# EAGLE design Daysuntil (EAGLE 6.3)
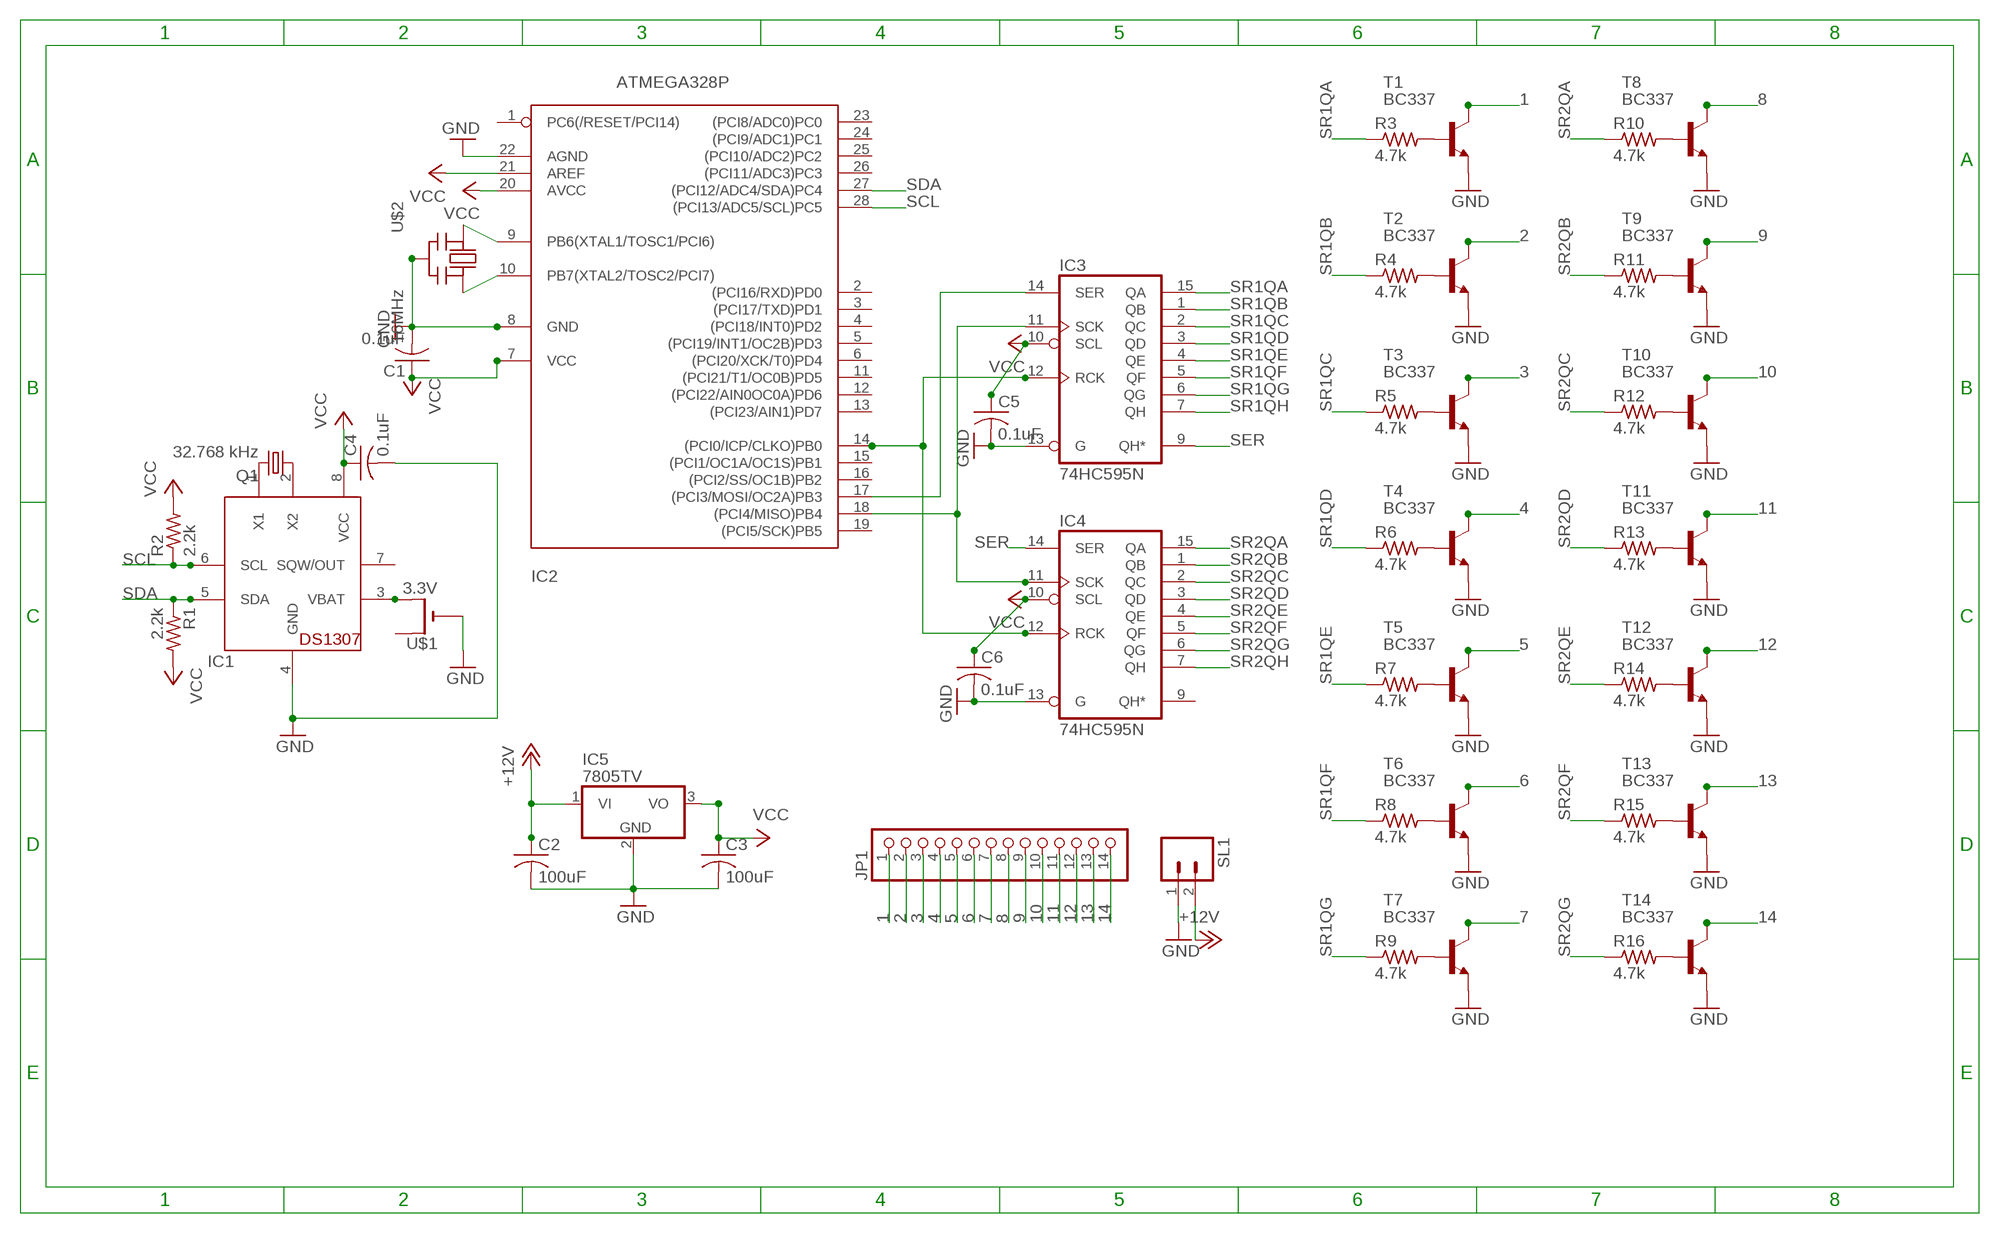
[diagram p0: schematic, sheet 1]

## Parts
C1  0.1uF  C-US025-030X050  [C025-030X050]
C2  100uF  C-US050-050X075  [C050-050X075]
C3  100uF  C-US050-050X075  [C050-050X075]
C4  0.1uF  C-US025-030X050  [C025-030X050]
C5  0.1uF  C-US025-030X050  [C025-030X050]
C6  0.1uF  C-US025-030X050  [C025-030X050]
IC1  DS1307  [DIL08]
IC2  ATMEGA328P  ATMEGA168-20P  [DIL28-3]
IC3  74HC595N  [DIL16]
IC4  74HC595N  [DIL16]
IC5  7805TV  [TO220V]
JP1  PINHD-1X14  [1X14]
Q1  32.768 kHz  CRYSTALTC38H  [TC38H]
R1  2.2k  R-US_0309/V  [0309V]
R2  2.2k  R-US_0309/V  [0309V]
R3  4.7k  R-US_0309/V  [0309V]
R4  4.7k  R-US_0309/V  [0309V]
R5  4.7k  R-US_0309/V  [0309V]
R6  4.7k  R-US_0309/V  [0309V]
R7  4.7k  R-US_0309/V  [0309V]
R8  4.7k  R-US_0309/V  [0309V]
R9  4.7k  R-US_0309/V  [0309V]
R10  4.7k  R-US_0309/V  [0309V]
R11  4.7k  R-US_0309/V  [0309V]
R12  4.7k  R-US_0309/V  [0309V]
R13  4.7k  R-US_0309/V  [0309V]
R14  4.7k  R-US_0309/V  [0309V]
R15  4.7k  R-US_0309/V  [0309V]
R16  4.7k  R-US_0309/V  [0309V]
SL1  M02  [02P]
T1  BC337  [TO92]
T2  BC337  [TO92]
T3  BC337  [TO92]
T4  BC337  [TO92]
T5  BC337  [TO92]
T6  BC337  [TO92]
T7  BC337  [TO92]
T8  BC337  [TO92]
T9  BC337  [TO92]
T10  BC337  [TO92]
T11  BC337  [TO92]
T12  BC337  [TO92]
T13  BC337  [TO92]
T14  BC337  [TO92]
U$1  3.3V  CR1220THM  [CR1220-THM]
U$2  16MHz  CERMOSCILL-THM  [CERM_OSC]

## Nets
1: JP1.1 T1.3(C)
2: JP1.2 T2.3(C)
3: JP1.3 T3.3(C)
4: JP1.4 T4.3(C)
5: JP1.5 T5.3(C)
6: JP1.6 T6.3(C)
7: JP1.7 T7.3(C)
8: JP1.8 T8.3(C)
9: JP1.9 T9.3(C)
10: JP1.10 T10.3(C)
11: JP1.11 T11.3(C)
12: JP1.12 T12.3(C)
13: JP1.13 T13.3(C)
14: JP1.14 T14.3(C)
+12V: C2.1 IC5.1(VI) SL1.2
GND: C1.2 C2.2 C3.2 C4.2 C5.2 C6.2 IC1.4(GND) IC2.8(GND) IC2.22(AGND) IC3.13(G) IC4.13(G) IC5.2(GND) SL1.1 T1.1(E) T2.1(E) T3.1(E) T4.1(E) T5.1(E) T6.1(E) T7.1(E) T8.1(E) T9.1(E) T10.1(E) T11.1(E) T12.1(E) T13.1(E) T14.1(E) U$1.- U$2.P$2(GND)
N$1: R3.2 T1.2(B)
N$2: IC2.17((PCI3/MOSI/OC2A)PB3) IC3.14(SER)
N$3: IC1.3(VBAT) U$1.+2(+1)
N$4: IC1.1(X1) Q1.2
N$5: IC1.2(X2) Q1.1
N$6: IC2.18((PCI4/MISO)PB4) IC3.11(SCK) IC4.11(SCK)
N$7: IC2.14((PCI0/ICP/CLKO)PB0) IC3.12(RCK) IC4.12(RCK)
N$8: IC2.9(PB6(XTAL1/TOSC1/PCI6)) U$2.P$1(IN)
N$9: IC2.10(PB7(XTAL2/TOSC2/PCI7)) U$2.P$3(OUT)
N$10: R4.2 T2.2(B)
N$11: R5.2 T3.2(B)
N$12: R6.2 T4.2(B)
N$13: R7.2 T5.2(B)
N$14: R8.2 T6.2(B)
N$15: R9.2 T7.2(B)
N$16: R10.2 T8.2(B)
N$17: R11.2 T9.2(B)
N$18: R12.2 T10.2(B)
N$19: R13.2 T11.2(B)
N$20: R14.2 T12.2(B)
N$21: R15.2 T13.2(B)
N$22: R16.2 T14.2(B)
SCL: IC1.6(SCL) IC2.28((PCI13/ADC5/SCL)PC5) R2.1
SDA: IC1.5(SDA) IC2.27((PCI12/ADC4/SDA)PC4) R1.1
SER: IC3.9(QH*) IC4.14(SER)
SR1QA: IC3.15(QA) R3.1
SR1QB: IC3.1(QB) R4.1
SR1QC: IC3.2(QC) R5.1
SR1QD: IC3.3(QD) R6.1
SR1QE: IC3.4(QE) R7.1
SR1QF: IC3.5(QF) R8.1
SR1QG: IC3.6(QG) R9.1
SR1QH: IC3.7(QH)
SR2QA: IC4.15(QA) R10.1
SR2QB: IC4.1(QB) R11.1
SR2QC: IC4.2(QC) R12.1
SR2QD: IC4.3(QD) R13.1
SR2QE: IC4.4(QE) R14.1
SR2QF: IC4.5(QF) R15.1
SR2QG: IC4.6(QG) R16.1
SR2QH: IC4.7(QH)
VCC: C1.1 C3.1 C4.1 C5.1 C6.1 IC1.8(VCC) IC2.7(VCC) IC2.20(AVCC) IC2.21(AREF) IC3.10(SCL) IC4.10(SCL) IC5.3(VO) R1.2 R2.2
Unconnected: IC1.7(SQW/OUT) IC2.1(PC6(/RESET/PCI14)) IC2.2((PCI16/RXD)PD0) IC2.3((PCI17/TXD)PD1) IC2.4((PCI18/INT0)PD2) IC2.5((PCI19/INT1/OC2B)PD3) IC2.6((PCI20/XCK/T0)PD4) IC2.11((PCI21/T1/OC0B)PD5) IC2.12((PCI22/AIN0OC0A)PD6) IC2.13((PCI23/AIN1)PD7) IC2.15((PCI1/OC1A/OC1S)PB1) IC2.16((PCI2/SS/OC1B)PB2) IC2.19((PCI5/SCK)PB5) IC2.23((PCI8/ADC0)PC0) IC2.24((PCI9/ADC1)PC1) IC2.25((PCI10/ADC2)PC2) IC2.26((PCI11/ADC3)PC3) IC4.9(QH*) U$1.+1(+)

## Power pins joined to a net without a drawn wire
GND: IC3.8(GND) IC4.8(GND)
VCC: IC3.16(VCC) IC4.16(VCC)

## Library data of the parts
C1-C6 = adafruit:C-US: CAPACITOR, American symbol
IC1 = adafruit:DS1307: DS1307 Real time clock (RTC) with battery backup ability. Talk to it via i2c
IC2 = adafruit:ATMEGA168*P: MICROCONTROLLER 16 kBytes FLASH 1 kBytes SRAM 512 Bytes EEPROM USART 8-channel 10 bit ADC
IC3 IC4 = 74xx-eu:74*595: 8-bit SHIFT REGISTER, output latch
IC5 = linear:78*: Positive VOLTAGE REGULATOR Source: http://cache.national.com/ds/LM/LM78L05.pdf http://www.fairchildsemi.com/ds/LM/LM7805.pdf
JP1 = pinhead:PINHD-1X14: PIN HEADER
Q1 = crystal:CRYSTAL: CRYSTAL; OC_FARNELL: unknown; OC_NEWARK: unknown
R1-R16 = adafruit:R-US_: RESISTOR, American symbol
SL1 = con-amp-quick:M02: AMP QUICK CONNECTOR; OC_FARNELL: unknown; OC_NEWARK: unknown
T1-T14 = transistor-neu-to92:BC337: NPN TRANSISTOR
U$1 = adafruit:CR1220: CR1216/CR1220/CR1225 12mm 3V lithium coin cell Great for battery packup. Both SMT and THM holders. Note the THM package has the ground pads on both sides of the PCB so that the masks are the same - this reduces the cost
U$2 = adafruit:CERMOSCILL: Ceramic oscillator with built in capacitors such as ZTT-12MHz http://www.ladyada.net/library/eagle

## Board
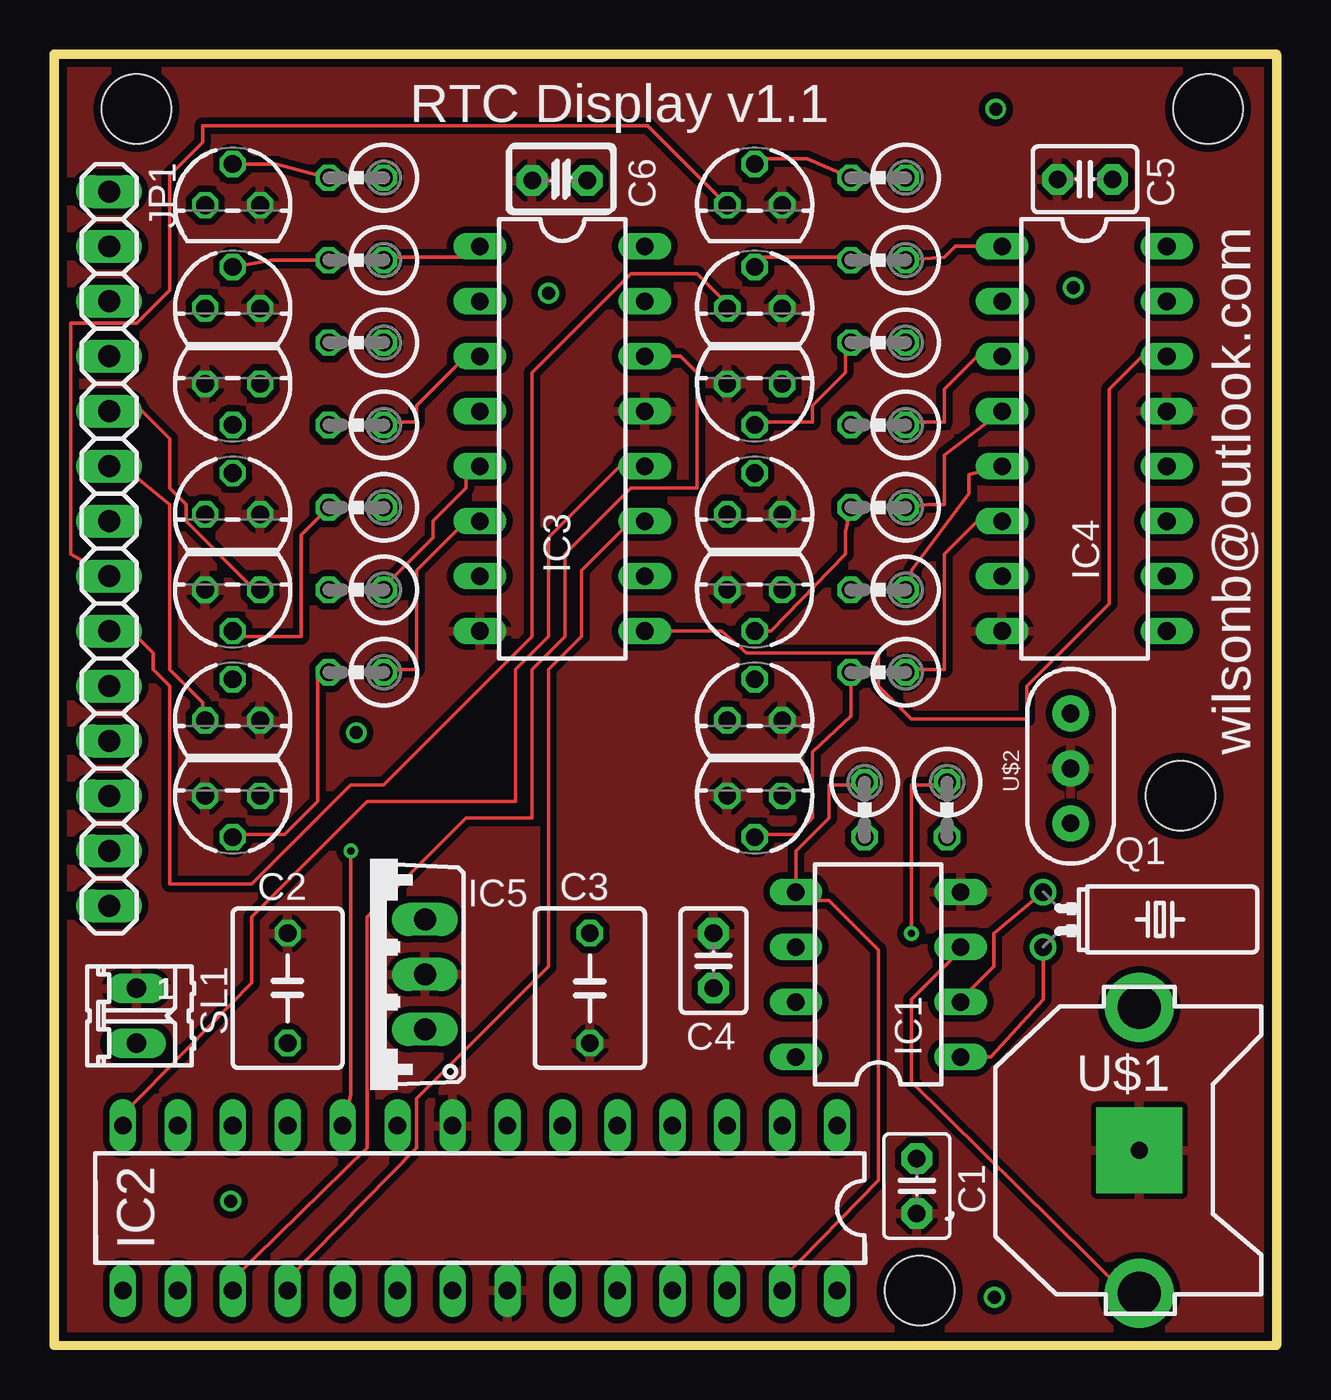
[diagram p1: board, top side]
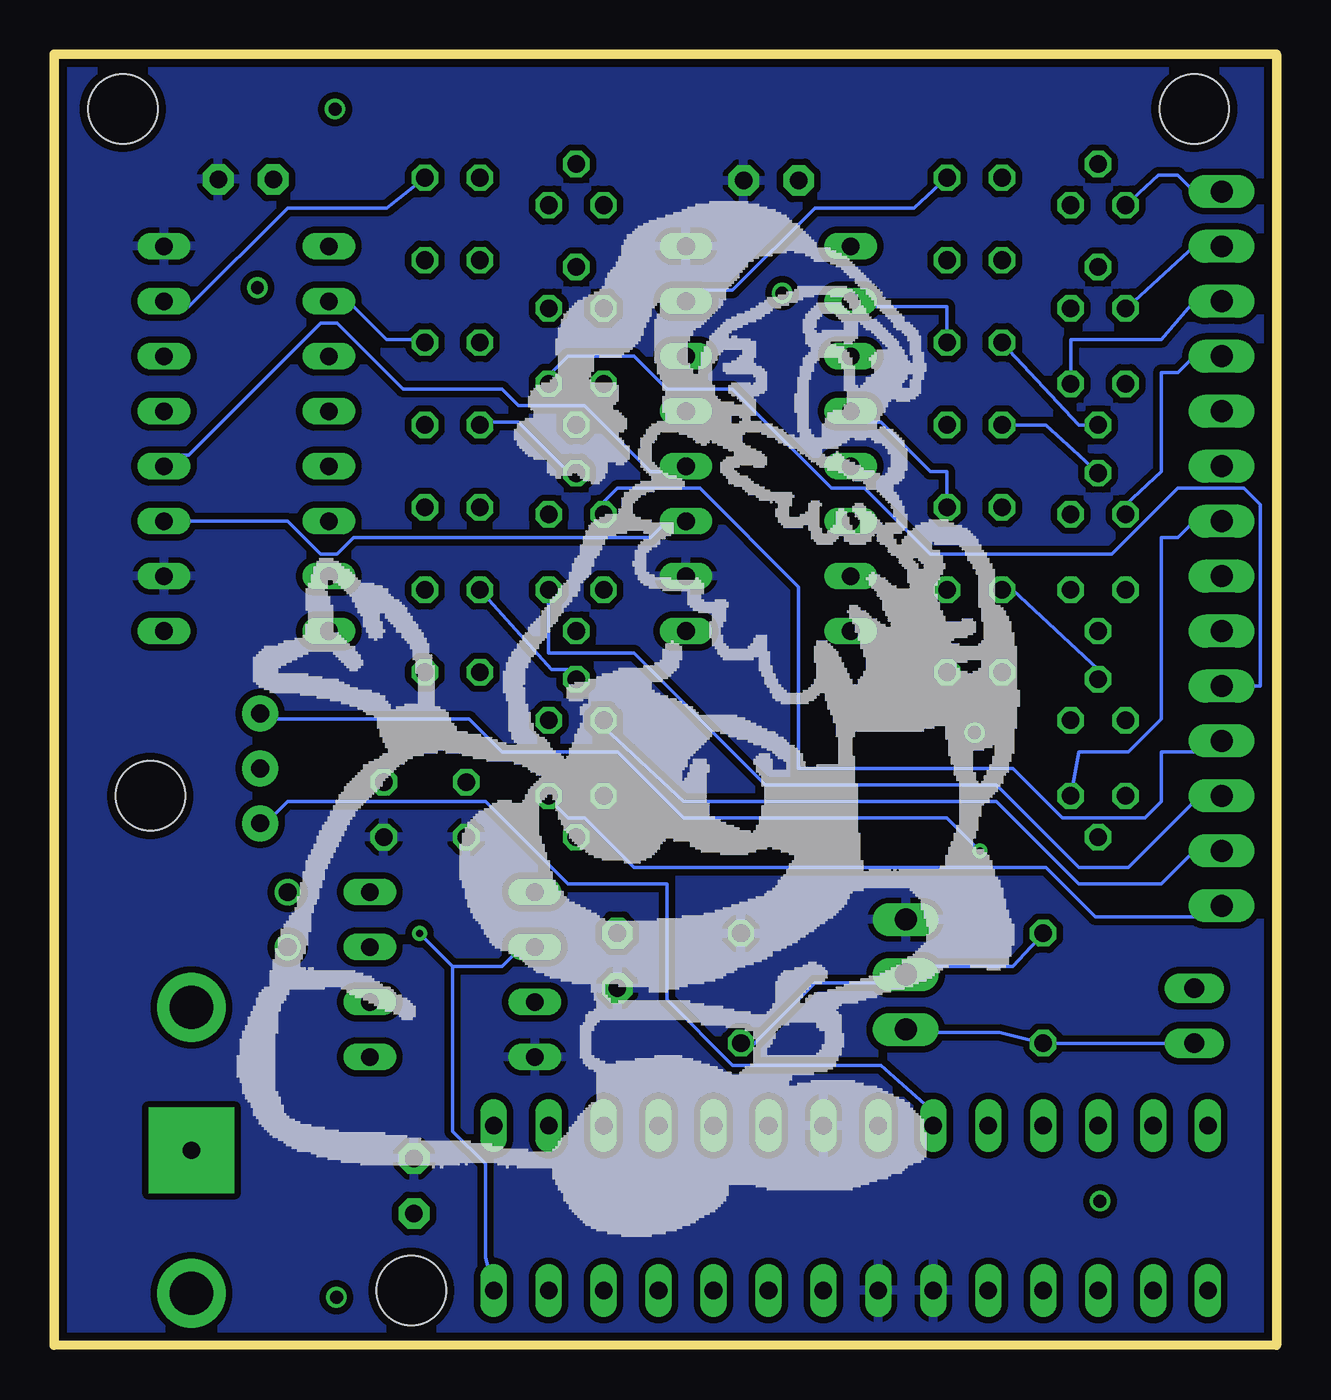
[diagram p2: board, bottom side, seen from below]

Size 56.52 x 59.69 mm. Coordinates in mm from the lower left corner, seen from the top.
Outline: 0,59.69 56.52,59.69 56.52,0 0,0 0,59.69
Copper layers (1*16): Top 0.0356mm / dielectric 1.5011mm / Bottom 0.0356mm
Design rules "LaenPCBOrder": minimum track width 6mil, minimum drill 13mil, track to track 6mil, track to pad 6mil, pad to pad 6mil, via to via 6mil, smd to smd 6mil, copper to edge 15mil, drill to drill 6mil, minimum pad ring 7mil, minimum via ring 7mil, stop-mask expansion 4mil, vias tented up to drill 0mil, thermal gap 10mil
Holes 3.2 mm at 40.01,2.54 53.34,57.15 52.07,25.4 3.81,57.15
Milling: 4 lines

### Footprints (pad centres in the part's own frame; a part is rotated, then mirrored left to right if it is on the bottom)
C025-030X050 = drill 0.813 pad 1.422 octagon: 1 -1.27,0; 2 1.27,0
C050-050X075 = drill 0.813 octagon: 1 -2.54,0; 2 2.54,0
DIL08 = drill 0.813 long: 1 -3.81,-3.81; 2 -1.27,-3.81; 3 1.27,-3.81; 4 3.81,-3.81; 5 3.81,3.81; 6 1.27,3.81; 7 -1.27,3.81; 8 -3.81,3.81
DIL28-3 = drill 0.813 long: 1 -16.51,-3.81; 2 -13.97,-3.81; 3 -11.43,-3.81; 4 -8.89,-3.81; 5 -6.35,-3.81; 6 -3.81,-3.81; 7 -1.27,-3.81; 8 1.27,-3.81; 9 3.81,-3.81; 10 6.35,-3.81; 11 8.89,-3.81; 12 11.43,-3.81; 13 13.97,-3.81; 14 16.51,-3.81; 15 16.51,3.81; 16 13.97,3.81; 17 11.43,3.81; 18 8.89,3.81; 19 6.35,3.81; 20 3.81,3.81; 21 1.27,3.81; 22 -1.27,3.81; 23 -3.81,3.81; 24 -6.35,3.81; 25 -8.89,3.81; 26 -11.43,3.81; 27 -13.97,3.81; 28 -16.51,3.81
DIL16 = drill 0.813 long: 1 -8.89,-3.81; 2 -6.35,-3.81; 3 -3.81,-3.81; 4 -1.27,-3.81; 5 1.27,-3.81; 6 3.81,-3.81; 7 6.35,-3.81; 8 8.89,-3.81; 9 8.89,3.81; 10 6.35,3.81; 11 3.81,3.81; 12 1.27,3.81; 13 -1.27,3.81; 14 -3.81,3.81; 15 -6.35,3.81; 16 -8.89,3.81
TO220V = drill 1.016 long: 1 -2.54,-2.54; 2 0,-2.54; 3 2.54,-2.54
1X14 = drill 1.016 long: 1 -16.51,0; 2 -13.97,0; 3 -11.43,0; 4 -8.89,0; 5 -6.35,0; 6 -3.81,0; 7 -1.27,0; 8 1.27,0; 9 3.81,0; 10 6.35,0; 11 8.89,0; 12 11.43,0; 13 13.97,0; 14 16.51,0
TC38H = drill 0.813: 1 -1.27,0; 2 1.27,0
0309V = drill 0.813 octagon: 1 -1.27,0; 2 1.27,0
02P = drill 0.914 long: 1 -1.27,0; 2 1.27,0
TO92 = drill 0.813 octagon: 1 1.27,0; 2 0,1.905; 3 -1.27,0
CR1220-THM = drill 2 pad 3.175: +1 -6.604,0; +2 6.604,0 | drill 0.8 pad 3.962 square: - 0,0
CERM_OSC = drill 0.813 pad 1.676: P$1 -2.54,0; P$2 0,0; P$3 2.54,0

### Placement (x,y rotation side)
C1  39.88,7.37 270 top
C2  10.79,16.51 90 top
C3  24.77,16.51 270 top
C4  30.48,17.78 90 top
C5  47.66,53.9 180 top
C6  23.37,53.85 180 top
IC1  38.1,17.14 90 top
IC2  19.68,6.35 180 top
IC3  23.5,41.91 270 top
IC4  47.62,41.91 270 top
IC5  14.61,17.14 90 top
JP1  2.54,36.83 270 top
Q1  45.72,19.68 270 top
R1  37.47,24.77 270 top
R2  41.27,24.77 270 top
R3  13.97,53.98 180 top
R4  13.97,50.16 180 top
R5  13.97,46.35 180 top
R6  13.97,42.55 180 top
R7  13.97,38.73 180 top
R8  13.97,34.92 180 top
R9  13.97,31.11 180 top
R10  38.1,53.98 180 top
R11  38.1,50.16 180 top
R12  38.1,46.35 180 top
R13  38.1,42.55 180 top
R14  38.1,38.73 180 top
R15  38.1,34.92 180 top
R16  38.1,31.11 180 top
SL1  3.81,15.24 270 top
T1  8.26,52.7 0 top
T2  8.26,47.94 0 top
T3  8.26,44.45 180 top
T4  8.26,38.42 0 top
T5  8.26,34.92 180 top
T6  8.26,28.89 0 top
T7  8.26,25.4 180 top
T8  32.38,52.7 0 top
T9  32.38,47.94 0 top
T10  32.38,44.45 180 top
T11  32.38,38.42 0 top
T12  32.38,34.92 180 top
T13  32.38,28.89 0 top
T14  32.38,25.4 180 top
U$1  50.16,9.02 270 top
U$2  46.99,26.67 90 top
U$3  [BITMAP-SLEIGHT]  3.81,4.11 0 top

### Tracks (layer width: path | path; a pad name or v marks a point on that pad's centre or on a via)
1
  Bottom 0.152: T1.3 5.46,54.1 4.57,54.1 3.81,53.34 JP1.1
2
  Bottom 0.152: JP1.2 3.81,50.8 6.86,48.01 T2.3
3
  Bottom 0.152: T3.3 9.53,46.48 5.33,46.48 3.81,48.26 JP1.3
4
  Bottom 0.152: JP1.4 3.81,45.72 4.57,44.96 5.33,44.96 5.33,40.39 6.99,38.86 T4.3
5
  Top 0.152: JP1.5 4.06,43.18 5.33,41.91 5.33,39.62 6.1,38.86 6.1,38.1 9.14,35.05 T5.3
6
  Top 0.152: T6.3 6.86,28.96 6.86,29.72 5.33,31.24 5.33,38.86 3.17,40.64 JP1.6
7
  Bottom 0.152: T7.3 9.14,27.43 6.86,27.43 5.33,28.96 5.33,37.34 4.57,37.34 3.81,38.1 JP1.7
8
  Top 0.152: JP1.8 0.76,36.58 0.76,47.24 3.81,47.24 5.33,48.77 5.33,54.1 6.86,55.63 6.86,56.39 27.43,56.39 T8.3 31.24,52.58
9
  Top 0.152: T9.3 31.24,48.01 29.72,49.53 26.67,49.53 22.1,44.96 22.1,32.77 15.24,25.91 13.72,25.91 9.14,21.34 5.33,21.34 5.33,30.48 4.57,31.24 4.57,32 3.05,33.53 JP1.9
10
  Bottom 0.152: JP1.10 0.76,30.48 0.76,38.86 1.52,39.62 4.57,39.62 7.62,36.58 16,36.58 19.05,39.62 20.57,39.62 25.15,44.2 28.19,44.2 29.72,45.72 32.77,45.72 33.53,44.96 T10.3
11
  Bottom 0.152: T11.3 31.24,38.86 30.48,39.62 26.67,39.62 22.1,35.05 22.1,26.67 12.19,26.67 9.91,24.38 6.1,24.38 5.33,25.15 5.33,27.43 3.05,27.43 JP1.11
12
  Bottom 0.152: T12.3 33.66,32 29.72,32 23.62,25.91 12.95,25.91 9.14,22.1 6.86,22.1 3.81,25.15 3.05,25.15 JP1.12
13
  Bottom 0.152: JP1.13 3.81,22.86 5.33,21.34 9.14,21.34 12.95,25.15 27.43,25.15 31.11,28.57 T13.3
14
  Bottom 0.152: T14.3 33.53,25.15 32.77,24.38 32,24.38 29.72,22.1 10.67,22.1 8.38,19.81 3.05,19.81 JP1.14
+12V
  Bottom 0.152: IC5.1 16.76,14.48 12.83,14.48 C2.1 SL1.2
GND
  Bottom 0.152: C2.2 12.19,17.53 16.76,17.53 IC5.2 17.53,16.76 21.34,16.76 24.38,13.72 C3.2
  pour Top (isolate 0.305): -2.54,62.23 -2.54,-2.54 83.19,-2.54 83.19,62.23
N$1
  Top 0.152: T1.2 10.29,54.61 12.19,54.1 R3.2
N$2
  Top 0.152: IC3.14 28.96,45.72 29.72,44.96 29.72,39.62 26.67,39.62 23.62,36.58 23.62,32.77 22.1,31.24 22.1,24.38 19.05,24.38 14.48,19.81 14.48,9.14 8.26,3.05 IC2.17
N$3
  Top 0.152: IC1.3 41.91,18.29 39.62,16 39.62,12.19 49.53,2.41 U$1.+2
N$4
  Top 0.152: Q1.2 45.72,16 43.31,13.34 IC1.1
N$5
  Top 0.152: Q1.1 43.43,19.05 43.43,17.53 41.91,16 IC1.2
N$6
  Top 0.152: IC2.18 10.79,3.05 16.76,9.14 16.76,11.43 22.86,17.53 22.86,31.24 24.38,32.77 24.38,35.81 26.67,38.1 IC3.11
  Bottom 0.152: IC4.11 45.72,38.1 44.2,36.58 43.43,36.58 42.67,37.34 28.96,37.34 28.19,38.1 IC3.11
N$7
  Top 0.152: IC2.14 3.17,10.67 9.14,16.76 9.14,19.81 14.48,25.15 21.34,25.15 21.34,31.24 22.86,32.77 22.86,37.34 26.67,41.15 IC3.12
  Bottom 0.152: IC4.12 51.05,41.15 50.29,41.15 44.2,47.24 43.43,47.24 40.39,44.2 35.81,44.2 35.05,43.43 32,43.43 28.96,40.39 27.43,40.39 IC3.12
N$8
  Bottom 0.152: IC2.9 15.88,10.79 18.29,12.95 25.15,12.95 28.19,16 28.19,21.34 32.77,21.34 36.58,25.15 45.72,25.15 46.48,24.38 U$2.P$1
N$9  (via drill 0.33)
  Top 0.152: v13.72,22.86 13.72,11.56 IC2.10
  Bottom 0.152: v13.72,22.86 15.24,24.38 27.43,24.38 30.48,27.43 35.81,27.43 37.34,28.96 46.48,28.96 U$2.P$3
N$10
  Top 0.152: T2.2 10.03,50.16 R4.2
N$11
  Bottom 0.152: T3.2 9.14,42.55 R5.2
N$12
  Bottom 0.152: R6.2 10.67,42.55 9.14,41.15 T4.2
N$13
  Top 0.152: T5.2 8.38,32.77 11.43,32.77 11.43,37.47 R7.2
N$14
  Bottom 0.152: T6.2 8.26,31.24 12.19,34.92 R8.2
N$15
  Top 0.152: T7.2 8.38,23.62 10.67,23.62 12.19,25.15 12.19,31.24 R9.2
N$16
  Top 0.152: R10.2 34.8,54.86 32.77,54.86 T8.2
N$17
  Top 0.152: T9.2 32.77,50.29 36.58,50.29 R11.2
N$18
  Top 0.152: T10.2 32.77,42.67 35.05,42.67 35.05,43.43 36.58,44.96 36.58,46.48 R12.2
N$19
  Bottom 0.152: T11.2 32.77,40.39 35.05,42.67 36.58,42.67 R13.2
N$20
  Top 0.152: T12.2 33.15,33.02 36.58,36.58 36.58,37.59 R14.2
N$21
  Bottom 0.152: R15.2 33.53,31.24 32.77,31.24 T13.2
N$22
  Top 0.152: T14.2 32.77,23.62 34.29,23.62 35.05,24.38 35.05,27.43 36.83,29.08 R16.2
N$24  (via drill 0.6)
  other vias: 43.53,57.15
N$25  (via drill 0.6)
  other vias: 43.47,2.22
N$26  (via drill 0.6)
  other vias: 8.17,6.67
N$27  (via drill 0.6)
  other vias: 22.86,48.64
N$28  (via drill 0.6)
  other vias: 47.12,48.9
N$29  (via drill 0.6)
  other vias: 13.97,28.32
SCL  (via drill 0.33)
  Top 0.152: v39.62,19.05 39.62,25.91 41.15,25.91 R2.1
  Bottom 0.152: 38.1,17.53 38.1,9.91 36.58,8.38 36.58,4.06 IC2.28 | 38.1,17.53 35.81,17.53 35.05,18.29 34.29,18.29 IC1.6 | 38.1,17.53 v39.62,19.05
SDA
  Top 0.152: IC2.27 33.66,3.05 38.1,7.62 38.1,18.29 35.81,20.57 34.29,20.57 IC1.5 34.29,22.86 35.81,24.38 35.81,25.91 37.34,25.91 R1.1
SER
  Top 0.152: IC3.9 30.86,33.02 32,32 38.1,32 38.1,30.48 39.62,28.96 44.96,28.96 44.96,30.48 48.77,34.29 48.77,44.2 50.29,45.72 IC4.14
SR1QA
  Bottom 0.152: R3.1 16.76,52.58 21.34,52.58 25.15,48.77 26.67,48.77 IC3.15
SR1QB
  Top 0.152: R4.1 15.24,50.29 19.05,50.29 IC3.1
SR1QC
  Bottom 0.152: R5.1 15.24,48.01 19.05,48.01 IC3.2
SR1QD
  Top 0.152: R6.1 15.24,42.67 16.76,42.67 16.76,43.43 19.05,45.72 IC3.3
SR1QE
  Bottom 0.152: R7.1 15.24,40.39 16,40.39 18.29,42.67 19.05,42.67 IC3.4
SR1QF
  Top 0.152: R8.1 15.24,35.05 17.53,37.34 17.53,38.1 19.05,39.62 19.05,40.39 IC3.5
SR1QG
  Top 0.152: R9.1 15.24,31.24 16.76,31.24 16.76,35.81 19.05,38.1 IC3.6
SR2QA
  Bottom 0.152: R10.1 41.15,52.58 45.72,52.58 50.29,48.01 51.05,48.01 IC4.15
SR2QB
  Top 0.152: R11.1 41.15,50.29 41.66,50.8 IC4.1
SR2QC
  Bottom 0.152: R12.1 39.62,46.48 41.15,46.48 42.67,48.01 43.43,48.01 IC4.2
SR2QD
  Top 0.152: IC4.3 42.67,45.72 41.15,44.2 41.15,42.67 39.62,42.67 R13.1
SR2QE
  Top 0.152: IC4.4 41.15,41.15 41.15,38.86 40.39,38.86 R14.1
SR2QF
  Top 0.152: R15.1 39.62,35.05 39.62,35.81 42.29,39.37 42.29,40.26 IC4.5
SR2QG
  Top 0.152: IC4.6 42.67,38.1 41.15,36.58 41.15,31.24 39.62,31.24 R16.1
VCC
  pour Bottom (isolate 0.305): -2.54,65.41 -2.54,-2.54 80.01,-2.54 80.01,65.41

### Text on the board
_tplace: RTC Display v1.1 | wilsonb@outlook.com | 1 | 1